# Altium schematic sheet PSDT ADC v1.0.0.SchDoc: Probe-Scope Digital Test: ADC
size Tabloid; CompanyName: Probe-Scope; Organization: Probe-Scope; Address1: Probe-Scope: Unified USB; Address2: Oscilloscope Probe; Address3: ©2019 M. Omo, J. Rowley,; Address4: K. Hall, released under the; DocumentNumber: SCH0020; SheetNumber: 2; PageSetup: Record=PageOptions|CenterHorizontal=True|CenterVertical=True|PrintScale=0.96|XCorrection=1.00|YCorrection=1.00|PrintKind=1|BorderSize=5000000|LeftOffset=0|BottomOffset=0|Orientation=2|PaperLength=1000|PaperWidth=1000|Scale=100|PaperSource=7|PrintQuality=-4|MediaType=1|DitherType=10|PaperKind=11x17|PrintScaleMode=1; Assembly: ASP0020; License: CERN OHL v1.2
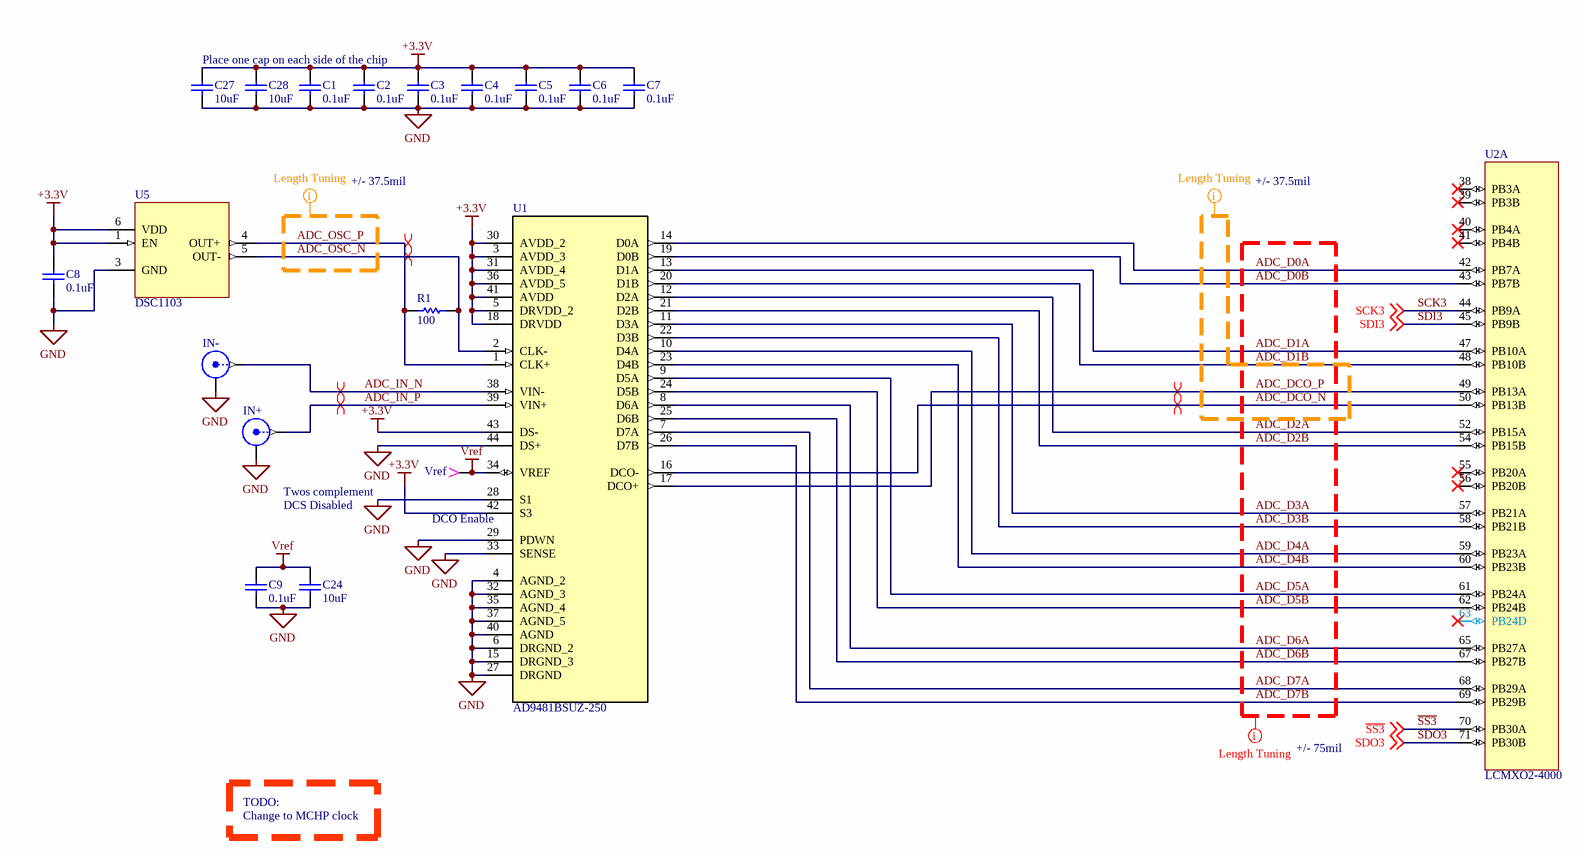
[diagram p0: PSDT ADC v1.0.0.SchDoc]

## Parts
C1  value 0.1uF  [0402(1005)]  (hidden comment: 6.3V)
C2  value 0.1uF  [0402(1005)]  (hidden comment: 6.3V)
C3  value 0.1uF  [0402(1005)]  (hidden comment: 6.3V)
C4  value 0.1uF  [0402(1005)]  (hidden comment: 6.3V)
C5  value 0.1uF  [0402(1005)]  (hidden comment: 6.3V)
C6  value 0.1uF  [0402(1005)]  (hidden comment: 6.3V)
C7  value 0.1uF  [0402(1005)]  (hidden comment: 6.3V)
C8  value 0.1uF  [0402(1005)]  (hidden comment: 6.3V)
C9  value 0.1uF  [0402(1005)]  (hidden comment: 6.3V)
C24  value 10uF  [0603(1608)]  (hidden comment: 25V)
C27  value 10uF  [0603(1608)]  (hidden comment: 25V)
C28  value 10uF  [0603(1608)]  (hidden comment: 25V)
IN+  SMA  [TE SMA Stright]  (value not drawn)
IN-  SMA  [TE SMA Stright]  (value not drawn)
R1  value 100  [0402(1005)]  (hidden comment: Res1)
U1  AD9481BSUZ-250  [QFP80P1200X1200X120-44N]
U2  LCMXO2-4000  [UL_TQFP144]  (part A of 5)
U5  DSC1103  [MCHP_H5A]
Vref  TP  [TESTPOINT024]  (value not drawn)

## Nets
+3.3V: C1.2 C2.2 C3.2 C4.2 C5.2 C6.2 C7.2 C8.2 C27.2 C28.2 U1.3(AVDD_3) U1.5(DRVDD_2) U1.18(DRVDD) U1.30(AVDD_2) U1.31(AVDD_4) U1.36(AVDD_5) U1.41(AVDD) U1.42(S3) U1.43(DS-) U5.1(EN) U5.6(VDD)
GND: C1.1 C2.1 C3.1 C4.1 C5.1 C6.1 C7.1 C8.1 C9.1 C24.1 C27.1 C28.1 IN+.2(Y) IN-.2(Y) U1.4(AGND_2) U1.6(DRGND_2) U1.15(DRGND_3) U1.27(DRGND) U1.28(S1) U1.29(PDWN) U1.32(AGND_3) U1.33(SENSE) U1.35(AGND_4) U1.37(AGND_5) U1.40(AGND) U1.44(DS+) U5.3(GND)
Vref: C9.2 C24.2 U1.34(VREF) Vref.1
ADC_D0A: U1.14(D0A) U2.42(PB7A)
ADC_D0B: U1.19(D0B) U2.43(PB7B)
ADC_D1A: U1.13(D1A) U2.47(PB10A)
ADC_D1B: U1.20(D1B) U2.48(PB10B)
ADC_D2A: U1.12(D2A) U2.52(PB15A)
ADC_D2B: U1.21(D2B) U2.54(PB15B)
ADC_D3A: U1.11(D3A) U2.57(PB21A)
ADC_D3B: U1.22(D3B) U2.58(PB21B)
ADC_D4A: U1.10(D4A) U2.59(PB23A)
ADC_D4B: U1.23(D4B) U2.60(PB23B)
ADC_D5A: U1.9(D5A) U2.61(PB24A)
ADC_D5B: U1.24(D5B) U2.62(PB24B)
ADC_D6A: U1.8(D6A) U2.65(PB27A)
ADC_D6B: U1.25(D6B) U2.67(PB27B)
ADC_D7A: U1.7(D7A) U2.68(PB29A)
ADC_D7B: U1.26(D7B) U2.69(PB29B)
ADC_DCO_N: U1.16(DCO-) U2.50(PB13B)
ADC_DCO_P: U1.17(DCO+) U2.49(PB13A)
ADC_IN_N: IN-.1(X) U1.38(VIN-)
ADC_IN_P: IN+.1(X) U1.39(VIN+)
ADC_OSC_N: R1.2 U1.2(CLK-) U5.5(OUT-)
ADC_OSC_P: R1.1 U1.1(CLK+) U5.4(OUT+)
~{SS3}: U2.70(PB30A) ; off-sheet ~{SS3}
SCK3: U2.44(PB9A) ; off-sheet SCK3
SDI3: U2.45(PB9B) ; off-sheet SDI3
SDO3: U2.71(PB30B) ; off-sheet SDO3

Not connected (* = marked no-connect by the designer): U2 38(PB3A)* 39(PB3B)* 40(PB4A)* 41(PB4B)* 55(PB20A)* 56(PB20B)* 63(PB24D)*

## Layout directives
differential pair: ADC_DCO_N, ADC_DCO_P, ADC_IN_N, ADC_IN_P, ADC_OSC_N, ADC_OSC_P
net class ADC_DATA - 150mil: ADC_D0A, ADC_D0B, ADC_D1A, ADC_D1B, ADC_D2A, ADC_D2B, ADC_D3A, ADC_D3B, ADC_D4A, ADC_D4B, ADC_D5A, ADC_D5B, ADC_D6A, ADC_D6B, ADC_D7A, ADC_D7B, ADC_DCO_N, ADC_DCO_P
net class ADC_CLK - 37.5mil: ADC_D1B, ADC_DCO_N, ADC_DCO_P
net class ADC_OSC - 37.5mil: ADC_OSC_N, ADC_OSC_P

## Notes on the sheet
- Place one cap on each side of the chip
- +/- 37.5mil
- (near IN+) Twos complement
- DCS Disabled
- (near U1) DCO Enable
- +/- 75mil
- TODO:
- Change to MCHP clock
- Title:
- Asm:
- Date:
- Variant:
- Time:
- Number:
- Sheet
- of
- Rev:
- File:

## Library data of the parts
C1-C9 = 1875: Key: 1875; MENG_PN: ???1875; MANF: Samsung Electro-Mechanics; MANF_PN: CL05B104KQ5NNNC; VENDOR: Digikey; VENDOR_PN: 1276-1511-1-ND; P&V Description: Capacitor, Ceramic, 0.1uF, 6.3V, 10% Tol, 125C, X7R, 0402, SMD; Class: Capacitor; Type: Ceramic; Other: X7R; Tolerance: 10; Voltage: 6.3; Max Temperature: 125; Approved: False; Package: 0402; SMD: True; Date Modified: 11/6/2018 11:14:02 AM; Modified By: jrowley; Parent Key: 1875; Verified: False
C24 C27 C28 = 1306: Key: 1306; MENG_PN: ???1306; MANF: Samsung Electro-Mechanics; MANF_PN: CL10A106MA8NRNC; VENDOR: Digikey; VENDOR_PN: 1276-1869-1-ND; P&V Description: Capacitor, Ceramic, 10uF, 25V, 20% Tol, 85C, X5R, 0603, SMD; Class: Capacitor; Type: Ceramic; Other: X5R; Tolerance: 20; Voltage: 25; Max Temperature: 85; Approved: True; Package: 0603; SMD: True; Date Modified: 3/3/2015 11:08:29 AM; Modified By: sotterbacher; Parent Key: 1306; Verified: True
IN+ IN- = 968: Key: 968; MENG_PN: ???968; MANF: TE Connectivity; MANF_PN: 5-1814832-1; VENDOR: Digikey; VENDOR_PN: A97594-ND; P&V Description: Connector, SMA, 1 Positions, Female, Vertical.  50 Ohm.  3 GHz.; Class: Connector; Other: Vertical.  50 Ohm.  3 GHz.; Positions: 1; Sex: Female; Approved: True; Type: SMA; SMD: False; Date Modified: 5/28/2013 3:41:34 PM; Modified By: rlaity; Parent Key: 968; Verified: True
R1 = 1823: Key: 1823; MENG_PN: ???1823; MANF: Yageo; MANF_PN: RC0402FR-07100RL; VENDOR: Digikey; VENDOR_PN: 311-100LRCT-ND; P&V Description: Resistor, Thick Film, 100 Ohms, 0.0625W, 1% Tol, 100V, 0402, SMD; Class: Resistor; Tolerance: 1; Power: 0.0625; Approved: False; Type: Thick Film; Package: 0402; SMD: True; Date Modified: 8/29/2018 2:46:23 AM; Modified By: jrowley; Voltage: 100; Expr1026: 1823; Parent Key: 1823; Verified: False
U1 = AD9481BSUZ-250: Single ADC Pipelined 250Msps 8-bit Parallel/LVDS 44-Pin TQFP Tray; VENDOR: DigiKey; MANF: Analog Devices Inc.; VENDOR_PN: AD9481BSUZ-250-ND; MANF_PN: AD9481BSUZ-250
U2 = MachXO2-4000-TG144: MANF: Lattice Semiconductor Corporation; MANF_PN: LCMXO2-4000HC-4TG144C; VENDOR: DigiKey; VENDOR_PN: 220-1460-ND
U5 = DSC1103: VENDOR: Mouser; MANF: Microchip Technology; MANF_PN: DSC1103CI3-250.0000; VENDOR_PN: 579-1103CI32500000
Vref = 49: Key: 49; MENG_PN: CON00002; MANF: Keystone Electronics; MANF_PN: 1998-3; VENDOR: Digikey; VENDOR_PN: 1998-3K-ND; P&V Description: Connector, Test Point, 1 Positions, Male, Small, 0.27" Straight Pin, 0.02" dia; Class: Connector; Other: Small, 0.27" Straight Pin, 0.02" dia; Approved: True; Positions: 1; Sex: Male; Type: Test Point; SMD: False; Date Modified: 9/30/2014 10:31:54 AM; Parent Key: 49; Verified: True; Modified By: sotterbacher